# EAGLE design Si4707_WeatherBandRadioBoardv1 (EAGLE 5.11)
PROJECT: Weather Band Radio Receiver Shield v1.0
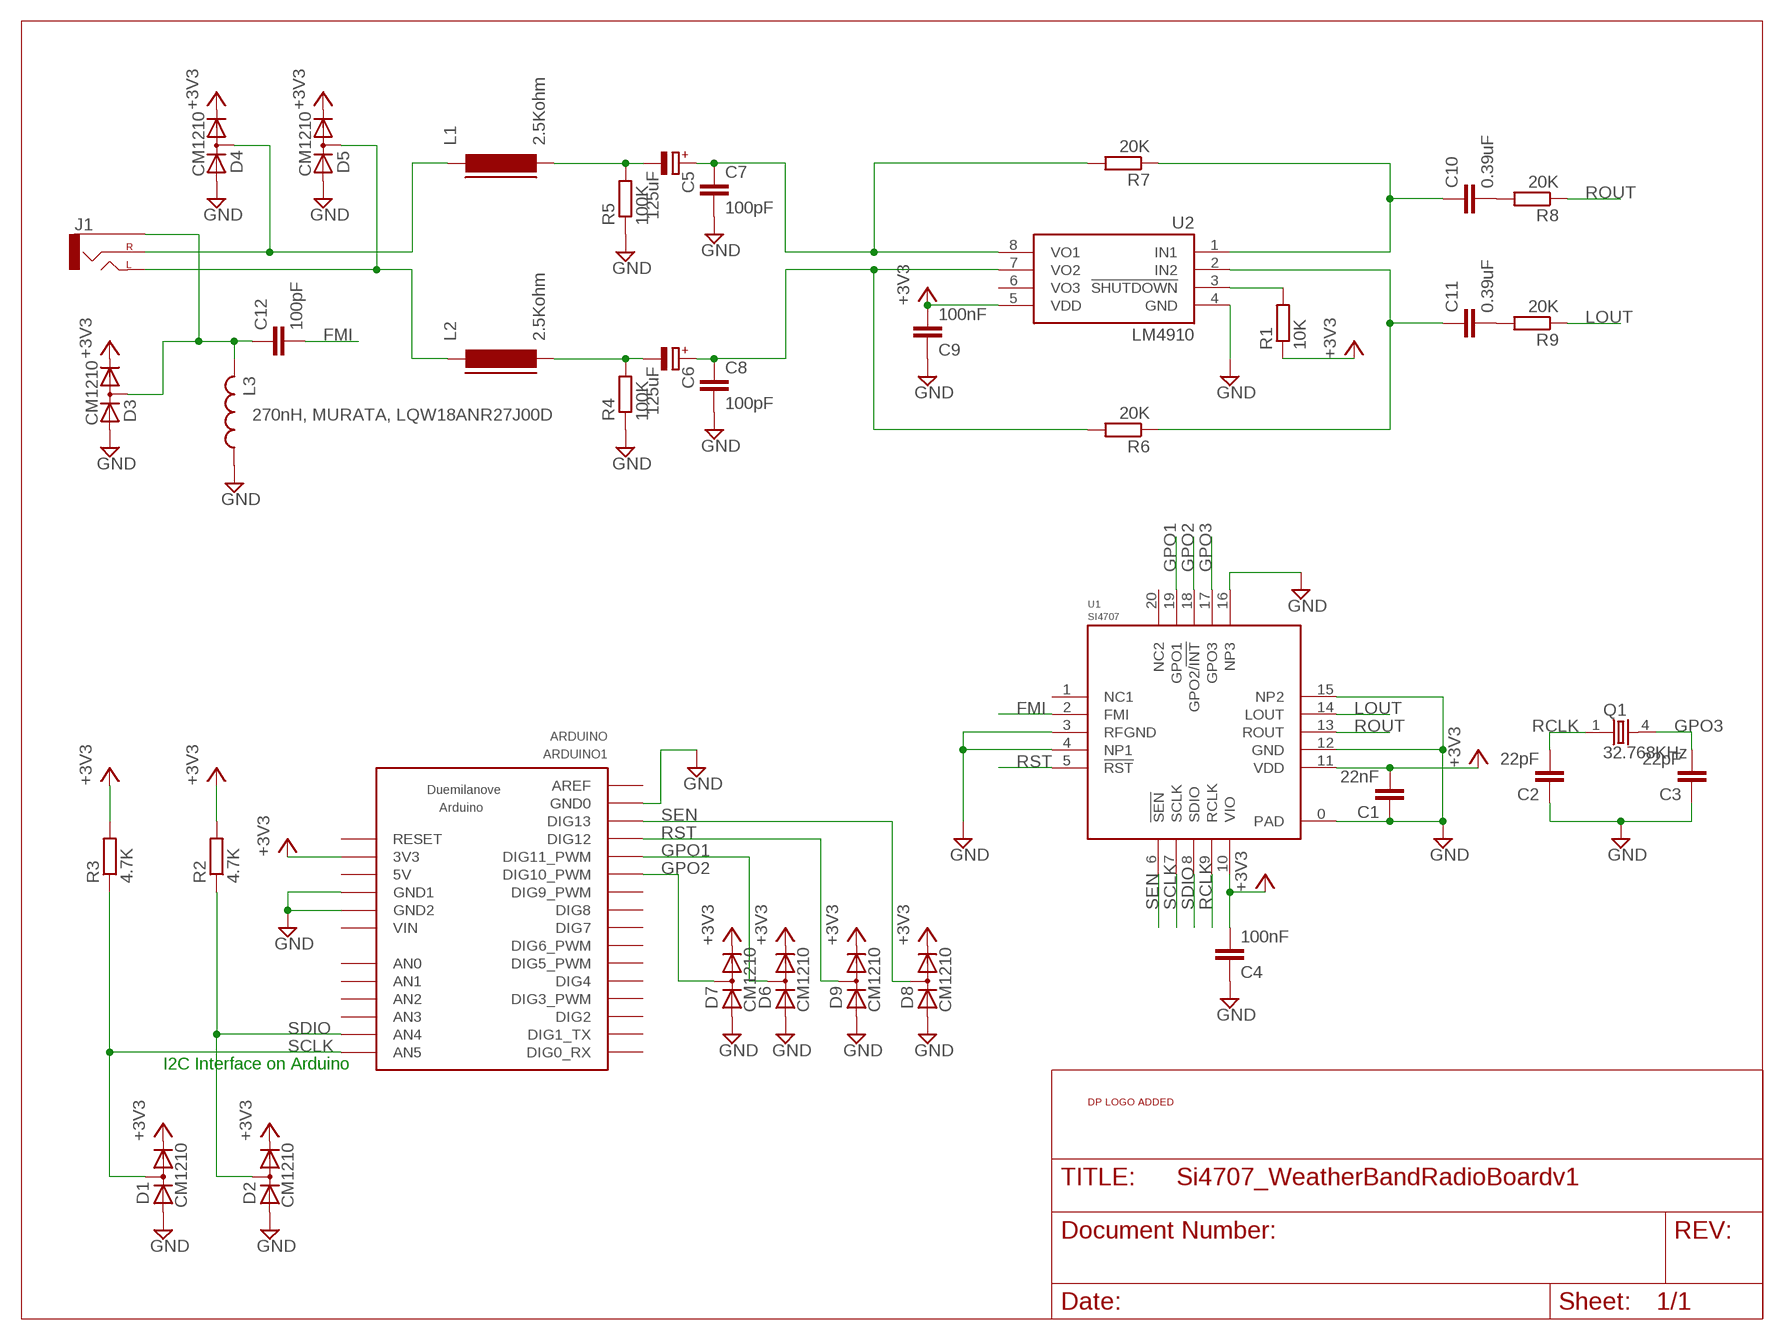
[diagram p0: schematic, sheet 1]

## Parts
ARDUINO1  ARDUINO  [ARDUINO]
C1  22nF  CAPC603  [C603]
C2  22pF  CAPC603  [C603]
C3  22pF  CAPC603  [C603]
C4  100nF  CAPC603  [C603]
C5  125uF  CAP_POLSMC_B  [SMC_B]
C6  125uF  CAP_POLSMC_B  [SMC_B]
C7  100pF  CAPC603  [C603]
C8  100pF  CAPC603  [C603]
C9  100nF  CAPC603  [C603]
C10  0.39uF  CAPC603  [C603]
C11  0.39uF  CAPC603  [C603]
C12  100pF  CAPC603  [C603]
D1  CM1210  [SOT23]
D2  CM1210  [SOT23]
D3  CM1210  [SOT23]
D4  CM1210  [SOT23]
D5  CM1210  [SOT23]
D6  CM1210  [SOT23]
D7  CM1210  [SOT23]
D8  CM1210  [SOT23]
D9  CM1210  [SOT23]
J1  AUDIO-JACKSMD  [STEREOJACK2.5MM_SMD]
L1  2.5Kohm  FERRITE_BEAD603  [FB603]
L2  2.5Kohm  FERRITE_BEAD603  [FB603]
L3  270nH, MURATA, LQW18ANR27J00D  L-USL2012C  [L2012C]
Q1  32.768KHz  86SMX  [86SMX]
R1  10K  RESISTORR603  [R603]
R2  4.7K  RESISTORR603  [R603]
R3  4.7K  RESISTORR603  [R603]
R4  100K  RESISTORR603  [R603]
R5  100K  RESISTORR603  [R603]
R6  20K  RESISTORR603  [R603]
R7  20K  RESISTORR603  [R603]
R8  20K  RESISTORR603  [R603]
R9  20K  RESISTORR603  [R603]
U1  SI4707  [QFN-20]
U2  LM4910  [SO8]
U$1  DP_LOGO  [DP_LOGO]

## Nets
FMI: C12.2 U1.2(FMI)
GND: ARDUINO1.GND0 ARDUINO1.GND1 ARDUINO1.GND2 C1.1 C2.1 C3.1 C4.1 C7.2 C8.2 C9.1 D1.3(A) D2.3(A) D3.3(A) D4.3(A) D5.3(A) D6.3(A) D7.3(A) D8.3(A) D9.3(A) L3.1 R4.1 R5.1 U1.0(PAD) U1.3(RFGND) U1.4(NP1) U1.12(GND) U1.15(NP2) U1.16(NP3) U2.4(GND)
GPO1: ARDUINO1.D_11(DIG11_PWM) D6.1(AC) U1.19(GPO1)
GPO2: ARDUINO1.D_10(DIG10_PWM) D7.1(AC) U1.18(GPO2/!INT)
GPO3: C3.2 Q1.4 U1.17(GPO3)
LOUT: R9.1 U1.14(LOUT)
N$1: C5.+ C7.1 R7.2 U2.8(VO1)
N$3: D4.1(AC) J1.4(RIGHT) L1.1
N$4: C6.- L2.2 R4.2
N$5: C5.- L1.2 R5.2
N$6: C6.+ C8.1 R6.2 U2.7(VO2)
N$7: R1.2 U2.3(!SHUTDOWN)
N$8: C11.1 R6.1 U2.2(IN2)
N$9: C10.1 R7.1 U2.1(IN1)
N$10: C10.2 R8.2
N$11: C11.2 R9.2
N$12: C12.1 D3.1(AC) J1.5(SLEEVE) L3.2
N$15: D5.1(AC) J1.1(LEFT) L2.1
RCLK: C2.2 Q1.1 U1.9(RCLK)
ROUT: R8.1 U1.13(ROUT)
RST: ARDUINO1.D_12(DIG12) D9.1(AC) U1.5(!RST)
SCLK: ARDUINO1.A_5(AN5) D1.1(AC) R3.1 U1.7(SCLK)
SDIO: ARDUINO1.A_4(AN4) D2.1(AC) R2.1 U1.8(SDIO)
SEN: ARDUINO1.D_13(DIG13) D8.1(AC) U1.6(!SEN)
VCC: ARDUINO1.3V3 C1.2 C4.2 C9.2 D1.2(C) D2.2(C) D3.2(C) D4.2(C) D5.2(C) D6.2(C) D7.2(C) D8.2(C) D9.2(C) R1.1 R2.2 R3.2 U1.10(VIO) U1.11(VDD) U2.5(VDD) ; supply symbol labelled +3V3
Unconnected: ARDUINO1.5V ARDUINO1.A_0(AN0) ARDUINO1.A_1(AN1) ARDUINO1.A_2(AN2) ARDUINO1.A_3(AN3) ARDUINO1.AREF ARDUINO1.D_0(DIG0_RX) ARDUINO1.D_1(DIG1_TX) ARDUINO1.D_2(DIG2) ARDUINO1.D_3(DIG3_PWM) ARDUINO1.D_4(DIG4) ARDUINO1.D_5(DIG5_PWM) ARDUINO1.D_6(DIG6_PWM) ARDUINO1.D_7(DIG7) ARDUINO1.D_8(DIG8) ARDUINO1.D_9(DIG9_PWM) ARDUINO1.RESET U1.1(NC1) U1.20(NC2) U2.6(VO3)

## Notes on the sheet
- I2C Interface on Arduino

## Power pins joined to a net without a drawn wire
VIN: ARDUINO1.VIN

## Library data of the parts
ARDUINO1 = dp_devices:ARDUINO
C1-C4 C7-C12 = dp_devices:CAP
C5 C6 = dp_devices:CAP_POL
D1-D9 = diode:CM1210
J1 = SparkFun:AUDIO-JACK: 3.5mm Audio Jack Simple 3.5mm common PCB mount audio jack. SKU: PRT-08032
L1 L2 = dp_devices:FERRITE_BEAD
L3 = rcl:L-US: INDUCTOR, American symbol
Q1 = crystal:86SMX: CRYSTAL; MF: C-MAC FREQUENCY PRODUCTS LTD; MPN: XTAL003321- 86SMX; OC_FARNELL: 6344914; OC_NEWARK: 01H9866
R1-R9 = dp_devices:RESISTOR
U1 = dp_devices:SI4707
U2 = dp_devices:LM4910
U$1 = dp_devices:DP_LOGO; FF1: fullfillment by; FF2: Seeed studio; FF3: www.seeedstudio.com; LICENSE: CC-BY-SA; PROJECT: project; URL1: http://; URL2: DangerousPrototypes.com

## Board
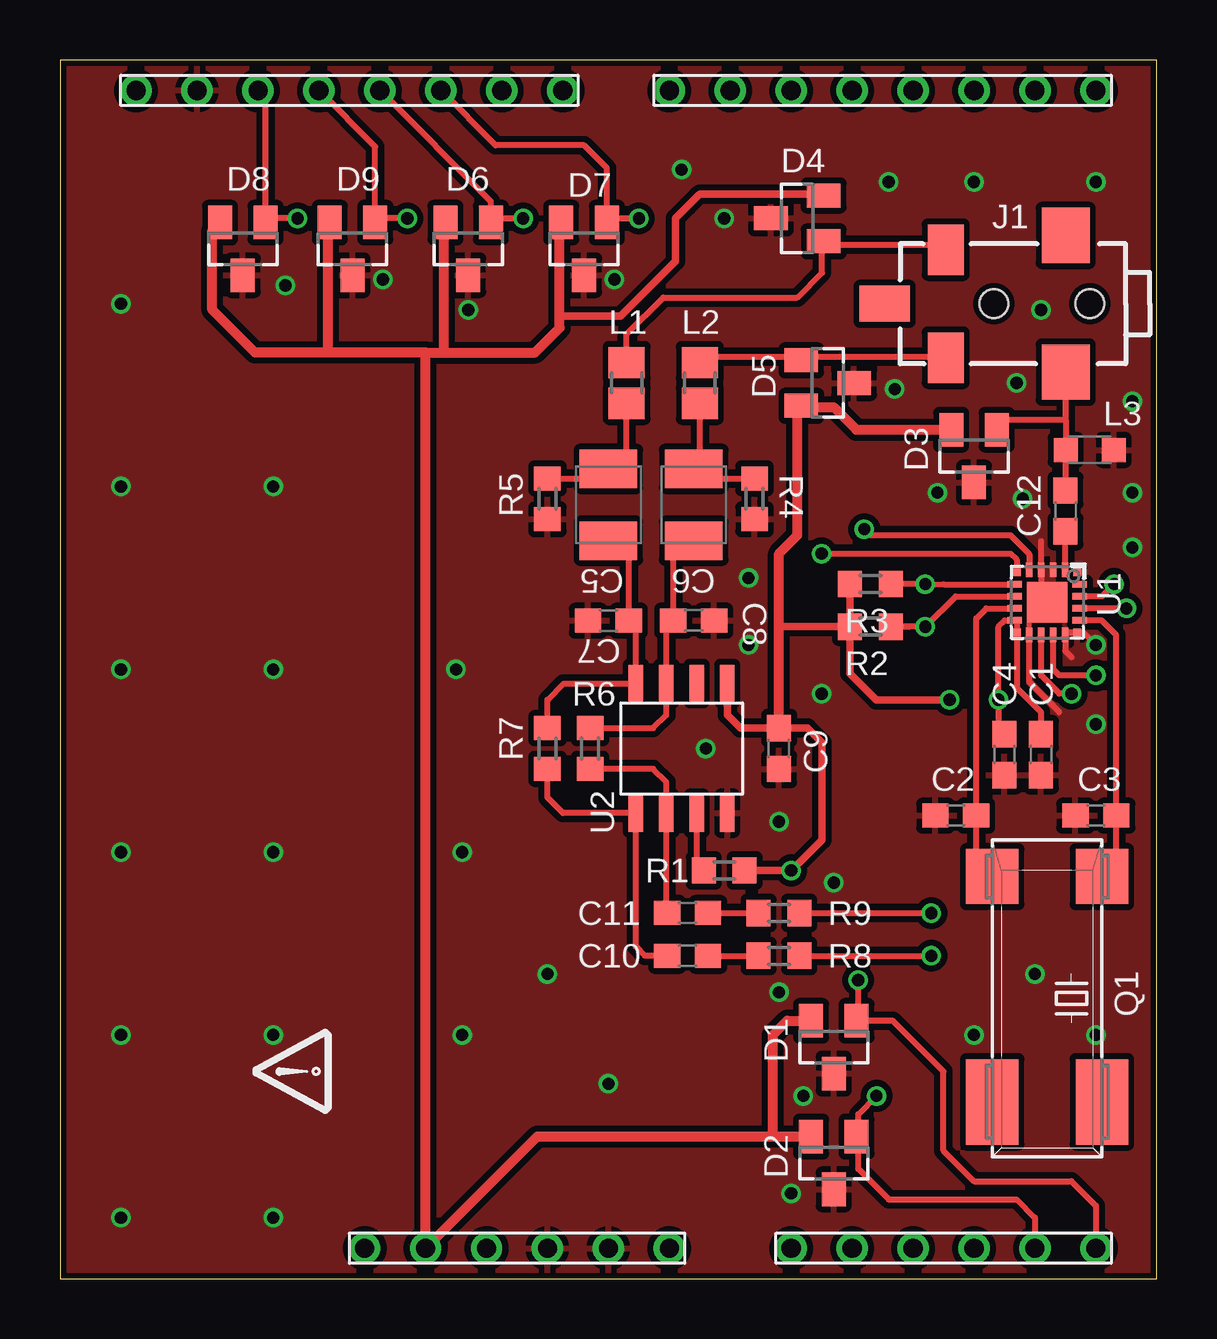
[diagram p1: board, top side]
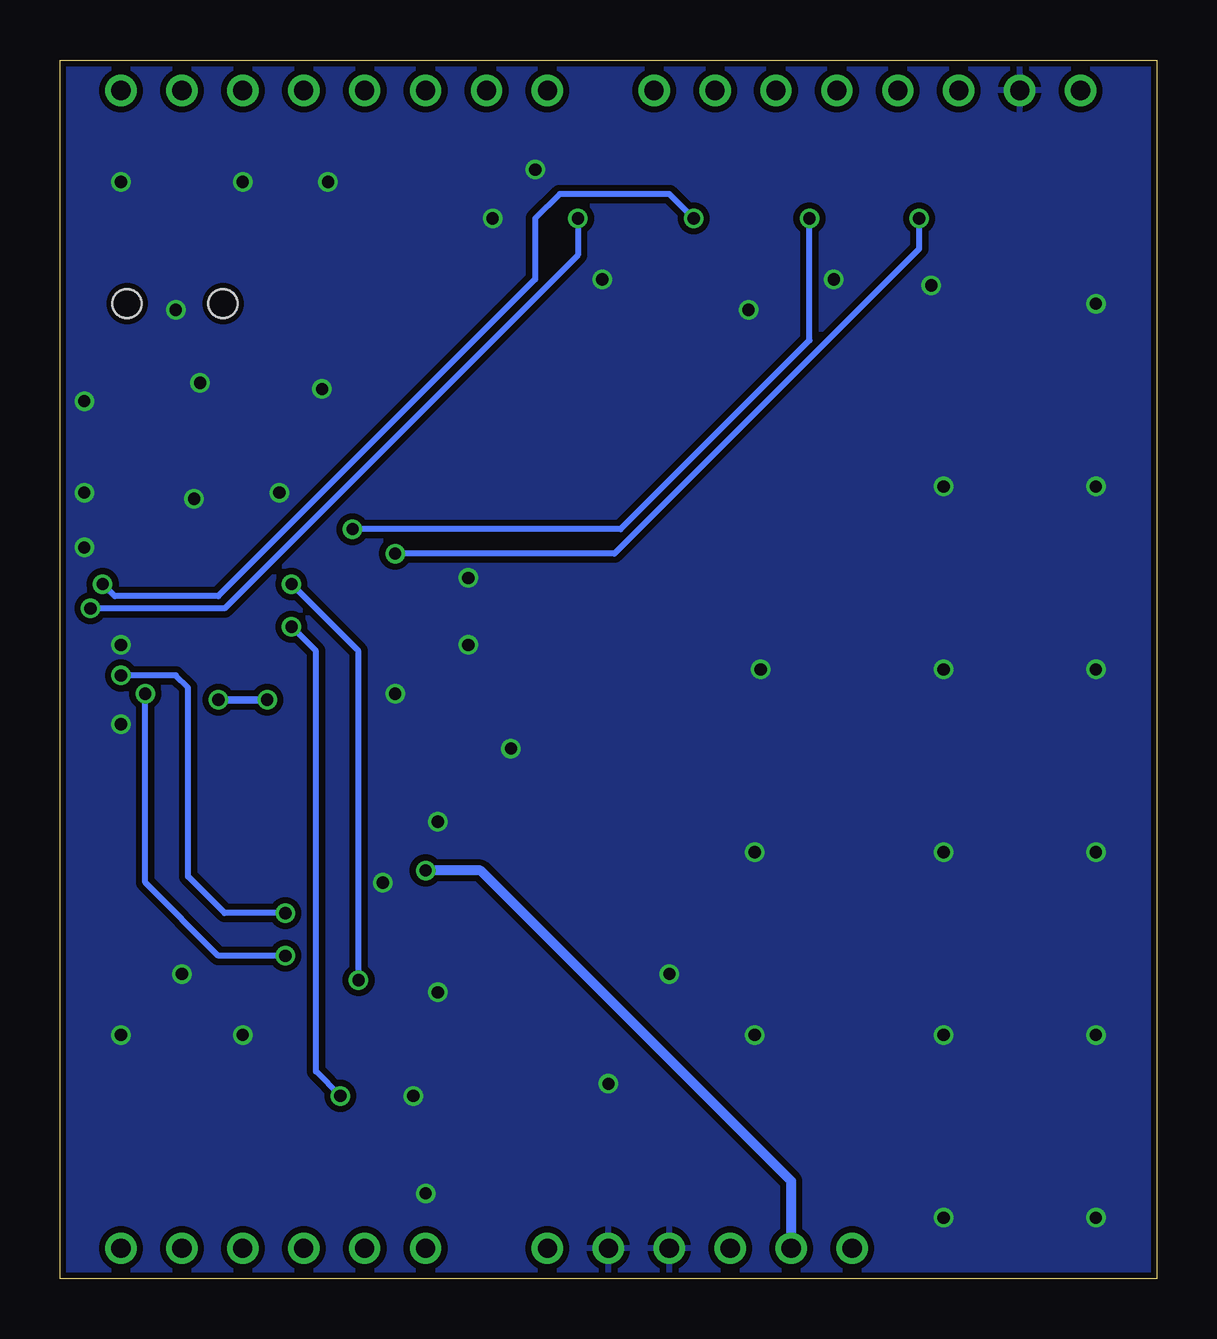
[diagram p2: board, bottom side, seen from below]

Size 45.72 x 50.8 mm. Coordinates in mm from the lower left corner, seen from the top.
Outline: 0,50.8 0,0 45.72,0 45.72,50.8 0,50.8
Copper layers (1*16): Top 0.035mm / dielectric 1.5mm / Bottom 0.035mm
Design rules "Fusion_eagle_rule_v1.1": minimum track width 6mil, minimum drill 12mil, track to track 6mil, track to pad 6mil, pad to pad 6mil, via to via 6mil, smd to smd 0mil, copper to edge 10mil, drill to drill 10mil, minimum pad ring 10mil, minimum via ring 6mil, stop-mask expansion 2mil, vias tented up to drill 100mil, thermal gap 10mil

### Footprints (pad centres in the part's own frame; a part is rotated, then mirrored left to right if it is on the bottom)
ARDUINO = drill 0.8 round: 3V3 25.4,-12.7; 5V 25.4,-10.16; A_0 25.4,2.54; A_1 25.4,5.08; A_2 25.4,7.62; A_3 25.4,10.16; A_4 25.4,12.7; A_5 25.4,15.24; AREF -22.86,-24.765; D_0 -22.86,15.24; D_1 -22.86,12.7; D_2 -22.86,10.16; D_3 -22.86,7.62; D_4 -22.86,5.08; D_5 -22.86,2.54; D_6 -22.86,0; D_7 -22.86,-2.54; D_8 -22.86,-6.985; D_9 -22.86,-9.525; D_10 -22.86,-12.065; D_11 -22.86,-14.605; D_12 -22.86,-17.145; D_13 -22.86,-19.685; GND0 -22.86,-22.225; GND1 25.4,-7.62; GND2 25.4,-5.08; RESET 25.4,-15.24; VIN 25.4,-2.54
C603 = smd 1.1 x 1: 1 -0.85,0; 2 0.85,0
SMC_B = smd 1.6 x 2.4: + -1.5,0; - 1.5,0
SOT23 = smd 1 x 1.4: 1 -0.95,-1.1; 2 0.95,-1.1; 3 0,1.1
STEREOJACK2.5MM_SMD = smd 1.5 x 2.1: 1 6,2.25; 4 6,-2.25 | smd 2.1 x 1.5: 3 8.55,0 | smd 2 x 2.3: 5 1,2.85; A 1,-2.85 | hole 1.2: 0,0; 4,0
FB603 = smd 1.3 x 1.5: 1 -0.85,0; 2 0.85,0
L2012C = smd 1 x 1: 1 -1,0; 2 1,0
86SMX = smd 2.286 x 2.184: 1 -5.08,-2.286; 4 -5.08,2.286 | smd 3.556 x 2.184: 2 4.318,-2.286; 3 4.318,2.286
R603 = smd 1 x 1.1: 1 -0.85,0; 2 0.85,0
QFN-20 = smd 1.7 x 1.7: 0 0,0 | smd 0.34 x 0.34: 1 -1.265,1.265; 6 -1.265,-1.265; 11 1.265,-1.265; 16 1.265,1.265 | smd 0.61 x 0.28: 2 -1.355,0.75; 3 -1.355,0.25; 4 -1.355,-0.25; 5 -1.355,-0.75; 12 1.355,-0.75; 13 1.355,-0.25; 14 1.355,0.25; 15 1.355,0.75 | smd 0.28 x 0.61: 7 -0.75,-1.355; 8 -0.25,-1.355; 9 0.25,-1.355; 10 0.75,-1.355; 17 0.75,1.355; 18 0.25,1.355; 19 -0.25,1.355; 20 -0.75,1.355
SO8 = smd 0.6 x 1.55: 1 -1.905,-2.69; 2 -0.635,-2.69; 3 0.635,-2.69; 4 1.905,-2.69; 5 1.905,2.71; 6 0.635,2.71; 7 -0.635,2.71; 8 -1.905,2.71

### Placement (x,y rotation side)
ARDUINO1  27.94,26.67 270 top
C1  40.89,21.84 90 top
C2  37.34,19.3 0 top
C3  43.18,19.3 0 top
C4  39.37,21.84 90 top
C5  22.86,32.26 90 top
C6  26.42,32.26 90 top
C7  22.86,27.43 180 top
C8  26.42,27.43 0 top
C9  29.97,22.1 90 top
C10  26.16,13.46 0 top
C11  26.16,15.24 0 top
C12  41.91,32 270 top
D1  32.26,9.65 180 top
D2  32.26,4.83 180 top
D3  38.1,34.29 180 top
D4  30.73,44.2 90 top
D5  32,37.34 270 top
D6  17.02,42.93 180 top
D7  21.84,42.93 180 top
D8  7.62,42.93 180 top
D9  12.19,42.93 180 top
J1  42.93,40.64 180 top
L1  23.62,37.34 270 top
L2  26.67,37.34 270 top
L3  42.93,34.54 180 top
Q1  41.15,11.68 270 top
R1  27.69,17.02 180 top
R2  33.78,27.18 180 top
R3  33.78,28.96 180 top
R4  28.96,32.51 90 top
R5  20.32,32.51 90 top
R6  22.1,22.1 90 top
R7  20.32,22.1 90 top
R8  29.97,13.46 180 top
R9  29.97,15.24 180 top
U1  41.15,28.19 270 top
U2  25.91,22.1 0 top
U$1  10.67,8.64 90 top

### Tracks (layer width: path | path; a pad name or v marks a point on that pad's centre or on a via)
FMI
  Top 0.254: U1.2 41.9,31.14 C12.2
GND  (via drill 0.51)
  Top 0.203: 40.41,26.82 40.41,26.92 40.41,27.43 40.44,27.46
  Top 0.254: U1.0 40.9,28.44 U1.4 40.9,30.74 | 40.41,26.92 40.4,26.91 U1.12 40.4,24.88 41.66,23.62 | 41.99,26.93 U1.16 42.67,26.93 v43.18,26.42 | U1.15 41.9,26.17 42.16,25.91
  other vias: 29.97,19.05 26.92,22.1 28.7,29.21 28.7,26.42 44.7,30.48 44.7,32.77 44.7,36.58 39.88,37.34 40.13,32.51 40.89,40.39 43.18,45.72 38.1,45.72 2.54,40.64 2.54,33.02 2.54,25.4 2.54,17.78 2.54,10.16 2.54,2.54 8.89,2.54 8.89,10.16 8.89,17.78 8.89,25.4 8.89,33.02 22.86,8.13 20.32,12.7 38.1,10.16 43.18,10.16 40.64,12.7 32.26,16.51 31.75,24.38 16.51,25.4 16.76,17.78 16.76,10.16 9.4,41.4 13.46,41.66 17.02,40.39 27.69,44.2 34.8,37.08 29.97,11.94 43.18,23.11 30.99,7.62 30.48,3.56 36.58,32.77 23.11,41.66 25.91,46.23 34.54,45.72
  pour Top (isolate 0.254): 0,0 45.72,0 45.72,50.8 0,50.8
  pour Bottom (isolate 0.254): 0,0 45.72,0 45.72,50.8 0,50.8
GPO1  (via drill 0.51)
  Top 0.254: U1.19 43.43,28.44 v43.94,28.96 | ARDUINO1.D_11 17.97,44.9 D6.1 18.14,44.2 v19.3,44.2
  Bottom 0.254: v43.94,28.96 43.43,28.45 39.12,28.45 25.91,41.66 25.91,44.2 24.89,45.21 20.32,45.21 v19.3,44.2
GPO2  (via drill 0.51)
  Top 0.254: U1.18 v44.45,27.94 | ARDUINO1.D_10 18.16,47.24 21.84,47.24 22.79,46.29 D7.1 22.96,44.2 v24.13,44.2
  Bottom 0.254: v44.45,27.94 38.86,27.94 24.13,42.67 v24.13,44.2
GPO3
  Top 0.254: U1.17 43.42,27.44 44.03,26.84 C3.2 44.03,17.36 Q1.4
LOUT  (via drill 0.51)
  Top 0.254: U1.14 41.4,25.4 41.66,25.15 v43.18,25.15 | R9.1 v36.32,15.24
  Bottom 0.254: v43.18,25.15 40.89,25.15 40.39,24.64 40.39,16.76 38.86,15.24 v36.32,15.24
N$1
  Top 0.254: C5.+ 22.88,30.73 23.62,30.73 23.71,30.65 C7.1 24,27.14 U2.8 21,24.81 20.32,24.13 R7.2
N$3
  Top 0.254: J1.4 36.72,43.1 31.98,43.1 D4.1 31.77,43.18 31.77,41.93 30.73,40.89 25.15,40.89 23.62,39.37 L1.1
  Top 0.305: D4.1 31.94,43.1
N$4
  Top 0.254: L2.2 26.67,34.01 C6.- 26.81,33.36 R4.2
N$5
  Top 0.254: L1.2 23.62,34.52 C5.- 22.46,33.36 R5.2
N$6
  Top 0.254: 26.42,30.99 C6.+ 26.14,30.48 25.65,30.48 25.57,30.39 C8.1 25.27,27.14 U2.7 25.27,23.5 24.73,22.95 R6.2
N$7
  Top 0.254: U2.3 26.54,17.31 R1.2
N$8
  Top 0.254: R6.1 24.73,21.25 25.27,20.7 U2.2 25.27,15.28 C11.1
N$9
  Top 0.254: R7.1 20.32,20.07 20.98,19.41 U2.1 24,13.84 24.38,13.46 C10.1
N$10
  Top 0.254: C10.2 R8.2
N$11
  Top 0.254: C11.2 R9.2
N$12
  Top 0.254: 41.93,35.81 L3.2 41.91,34.53 C12.1 | 41.93,35.81 J1.5 | D3.1 39.05,35.75 39.12,35.81 41.93,35.81
N$15
  Top 0.254: 26.87,38.39 L2.1 26.92,38.44 30.75,38.44 D5.1 31.05,38.44 36.88,38.44 J1.1
RCLK
  Top 0.254: U1.9 38.61,27.94 38.19,27.52 C2.2 38.19,17.44 Q1.1
ROUT  (via drill 0.51)
  Top 0.254: U1.13 40.9,25.14 41.66,24.38 v42.16,24.38 | R8.1 v36.32,13.46
  Bottom 0.254: v42.16,24.38 42.16,16.51 39.12,13.46 v36.32,13.46
RST  (via drill 0.51)
  Top 0.254: U1.5 40.4,30.21 39.62,30.99 33.78,30.99 v33.53,31.24 | ARDUINO1.D_12 13.14,47.18 D9.1 13.31,44.2 v14.48,44.2
  Bottom 0.254: v33.53,31.24 22.35,31.24 14.48,39.12 v14.48,44.2
SCLK  (via drill 0.51)
  Top 0.254: R3.1 v36.07,28.96 36.84,28.94 U1.7 | ARDUINO1.A_5 43.18,3.05 42.16,4.06 38.1,4.06 36.83,5.33 36.83,8.64 34.71,10.75 D1.1 33.27,10.82 v33.27,12.45
  Bottom 0.254: v33.27,12.45 33.27,26.16 v36.07,28.96
SDIO  (via drill 0.51)
  Top 0.254: 35.4,27.17 R2.1 v36.07,27.18 37.33,28.44 U1.8 | ARDUINO1.A_4 40.64,2.54 39.88,3.3 34.54,3.3 33.27,4.57 33.27,5.86 D2.1 33.21,6.03 33.27,6.1 33.27,6.86 v34.04,7.62
  Bottom 0.254: v34.04,7.62 35.05,8.64 35.05,26.16 v36.07,27.18
SEN  (via drill 0.51)
  Top 0.254: U1.6 39.88,29.97 39.62,30.23 v31.75,30.23 | ARDUINO1.D_13 8.57,49.22 D8.1 8.74,44.2 v9.91,44.2
  Bottom 0.254: v9.91,44.2 9.91,42.93 22.61,30.23 v31.75,30.23
VCC  (via drill 0.51)
  Top 0.254: C4.2 39.12,22.95 v39.12,24.13 39.12,27.18 39.38,27.44 U1.10 39.88,27.35 U1.11 39.88,24.63 40.89,23.62 C1.2
  Top 0.305: U2.5 27.81,23.5 28.36,22.95 C9.2 31.15,22.95 31.75,22.35 31.75,18.29 v30.48,17.02 R1.1 | R2.2 R3.2 | v37.08,24.13 34.04,24.13 32.93,25.23 R2.2 | 29.97,27.18 R2.2 | 20.83,40.13 23.37,40.13 25.65,42.42 25.65,44.2 26.16,44.7 26.6,45.15 26.67,45.21 32,45.21 31.94,45.15 D4.2
  Top 0.406: C9.2 29.97,27.18 29.97,30.23 30.73,30.99 30.73,36.22 D5.2 30.97,36.32 32.26,36.32 33.19,35.39 D3.2 | 29.72,5.93 19.9,5.93 ARDUINO1.3V3 15.24,38.61 | 29.72,5.93 D2.2 | D1.2 30.31,10.75 29.72,10.16 29.72,5.93 | D8.2 6.67,44.01 6.35,43.69 6.35,40.39 8.13,38.61 11.18,38.61 | 15.24,38.61 11.18,38.61 | 15.24,38.61 16,38.61 | 16,38.61 19.81,38.61 20.83,39.62 20.83,40.13 20.83,43.96 D7.2 | D6.2 16.07,44.01 16,43.94 16,38.61 | D9.2 11.24,44.01 11.18,43.94 11.18,38.61
  Bottom 0.305: v37.08,24.13 v39.12,24.13
  Bottom 0.406: v30.48,17.02 28.19,17.02 15.24,4.06 ARDUINO1.3V3